# Altium schematic sheet VER.SchDoc
size A3
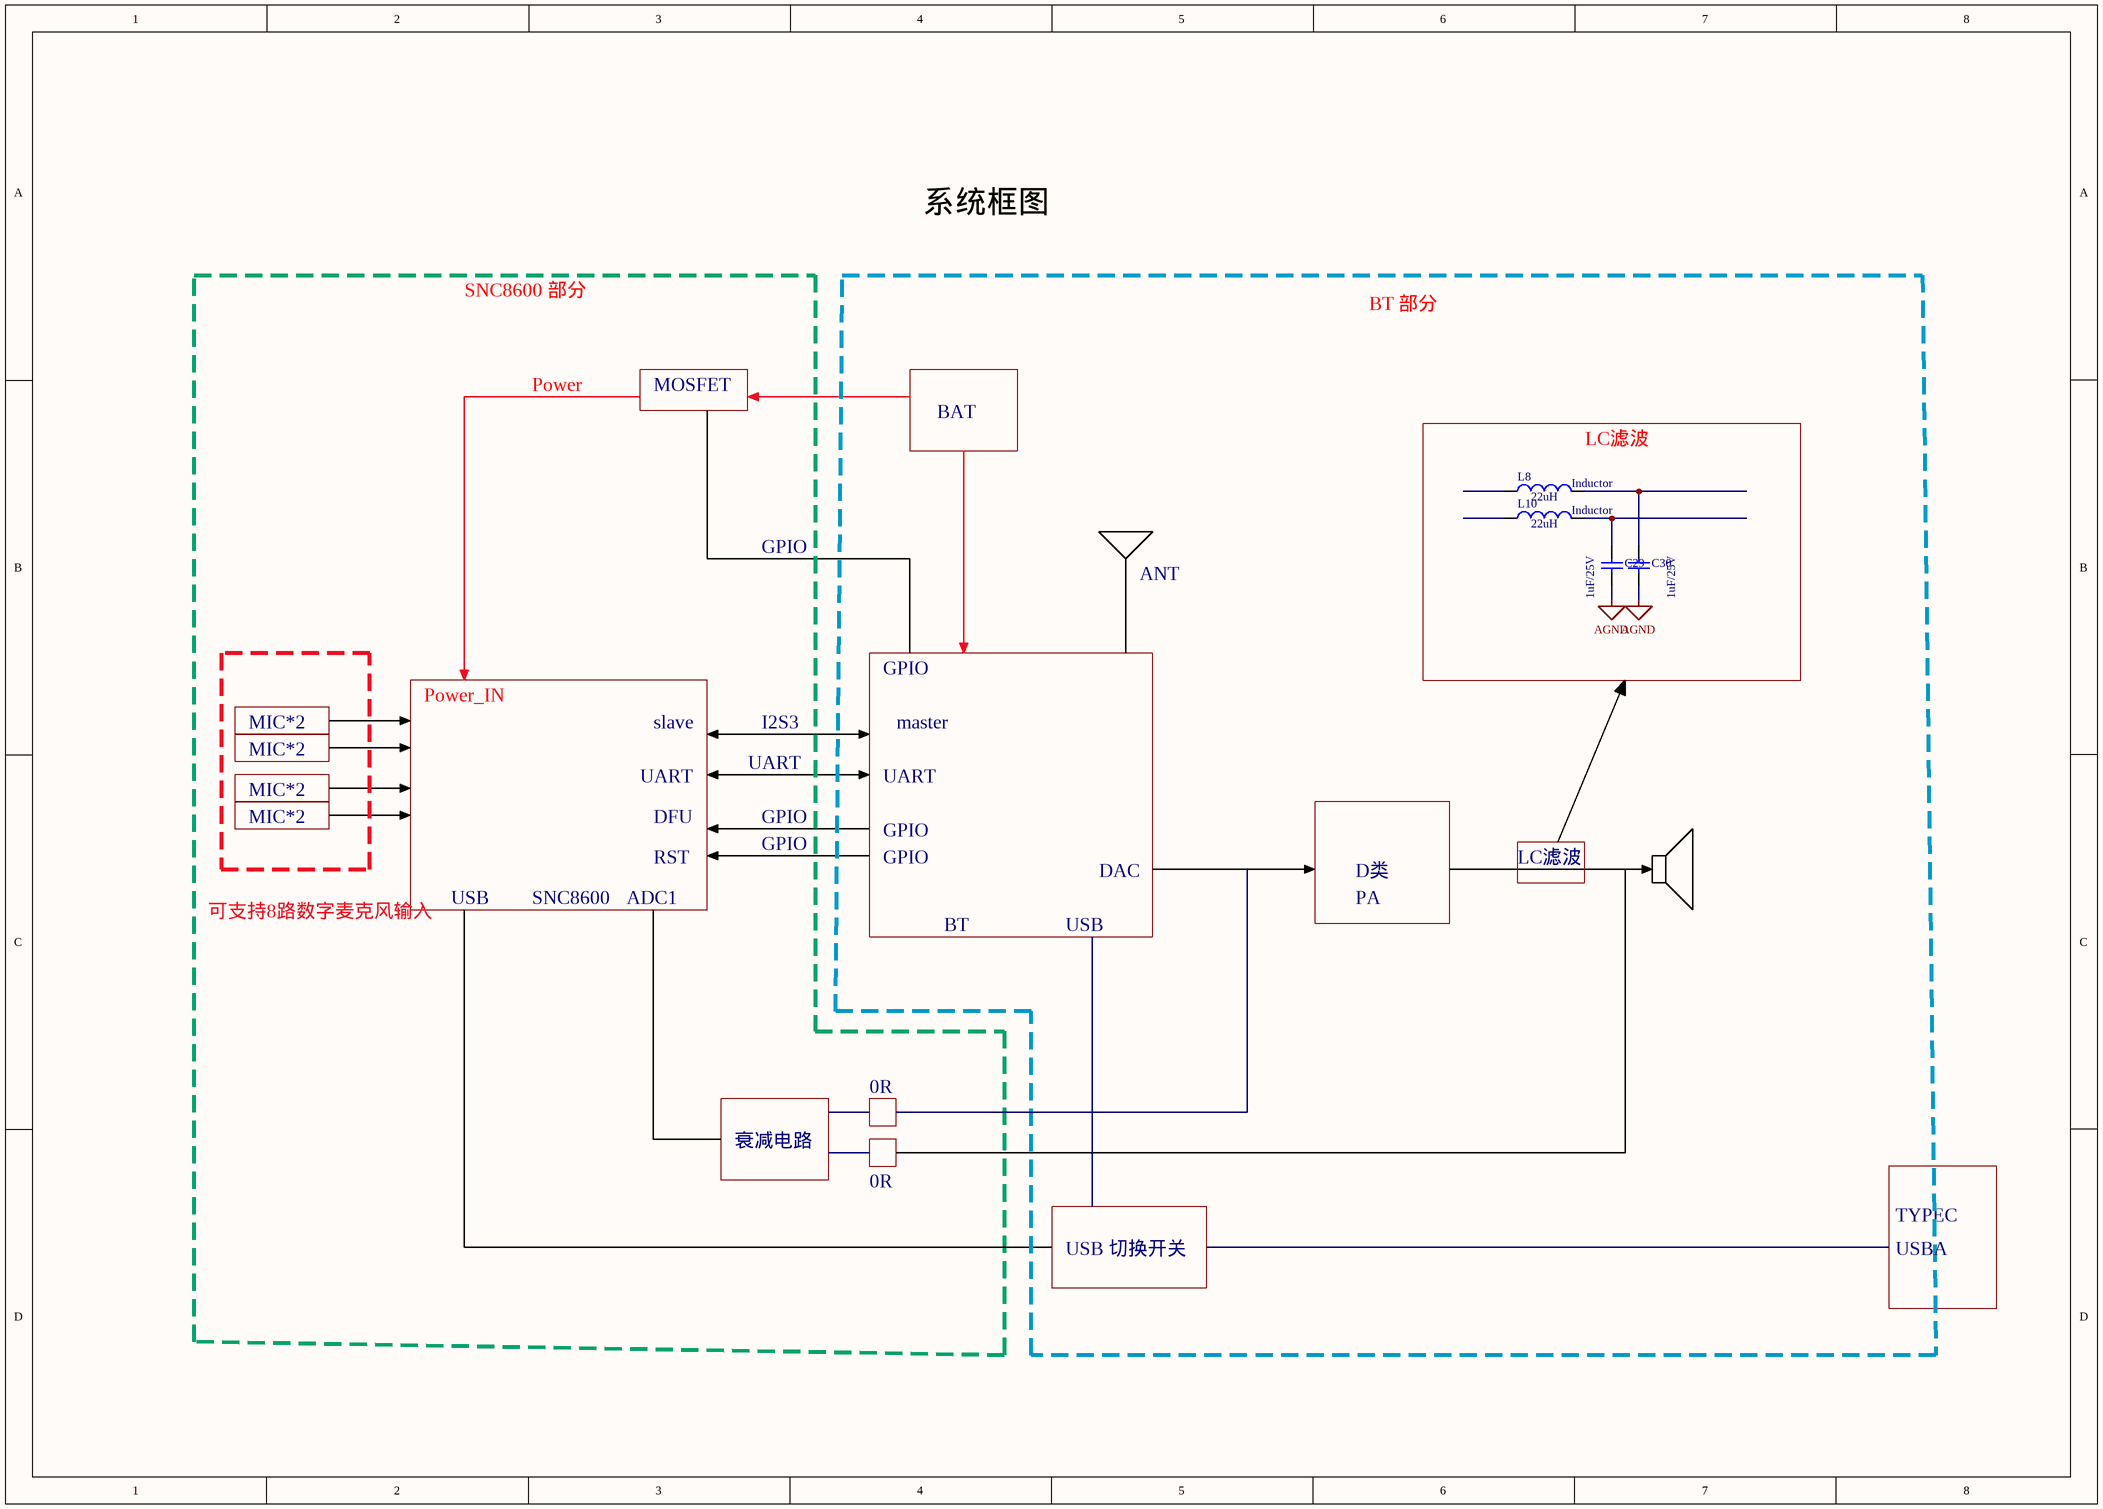
[diagram p0: VER.SchDoc]

## Parts
C29  1uF/25V  [C0603]
C30  1uF/25V  [C0603]
L8  Inductor  value 22uH  [0402-A]
L10  Inductor  value 22uH  [0402-A]

## Blocks framed on the sheet
LC滤波: C29 C30 L8 L10

## Nets
AGND: C29.1 C30.1
NetC29_2: C29.2 L10.2
NetC30_2: C30.2 L8.2

Not connected (* = marked no-connect by the designer): L8 1; L10 1

## Notes on the sheet
- 系统框图
- SNC8600 部分
- BT 部分
- Power
- MOSFET
- BAT
- GPIO
- ANT
- Power_IN
- MIC*2
- UART
- slave
- I2S3
- master
- DFU
- 可支持8路数字麦克风输入
- USB
- SNC8600
- ADC1
- RST
- DAC
- PA
- D类
- LC滤波
- BT
- 0R
- 衰减电路
- USB 切换开关
- TYPEC
- USBA

## Library data of the parts
C29 C30 = Cap Semi: Capacitor (Semiconductor SIM Model); Value: 100pF; Published: 8-Jun-2000; LatestRevisionDate: 29-May-2009; LatestRevisionNote: IPC-7351 Footprint Added.; PackageReference: C1206; Publisher: Altium Limited; PackageDescription: Chip Capacitor
L8 L10 = Inductor: Code_IEC: 1005; Published: 8-Jun-2000; LatestRevisionDate: 29-May-2009; LatestRevisionNote: IPC-7351 Footprint Added.; PackageReference: 0402-A; Publisher: Altium Limited; PackageDescription: Chip Inductor; Code_JEITA: 0402